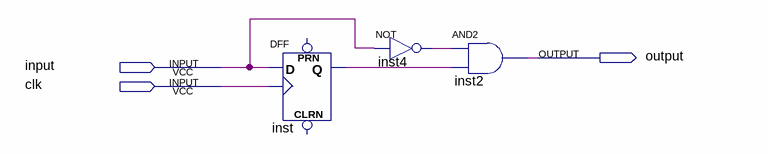
[diagram p0: schematic sheet]
// Quartus schematic FallingEdge.bdf as structural Verilog: 3 symbols, 3 pins
module FallingEdge (
  input  \input ,
  input  clk,
  output \output 
);

  wire inst4_out, inst_q;

  DFF inst (.CLK(clk), .D(\input ), .Q(inst_q));  // open: CLRN, PRN
  not inst4 (inst4_out, \input );
  and inst2 (\output , inst4_out, inst_q);
endmodule
